# EAGLE design Inductor-based non-neighbor balancing architecture (EAGLE 6.5.0)
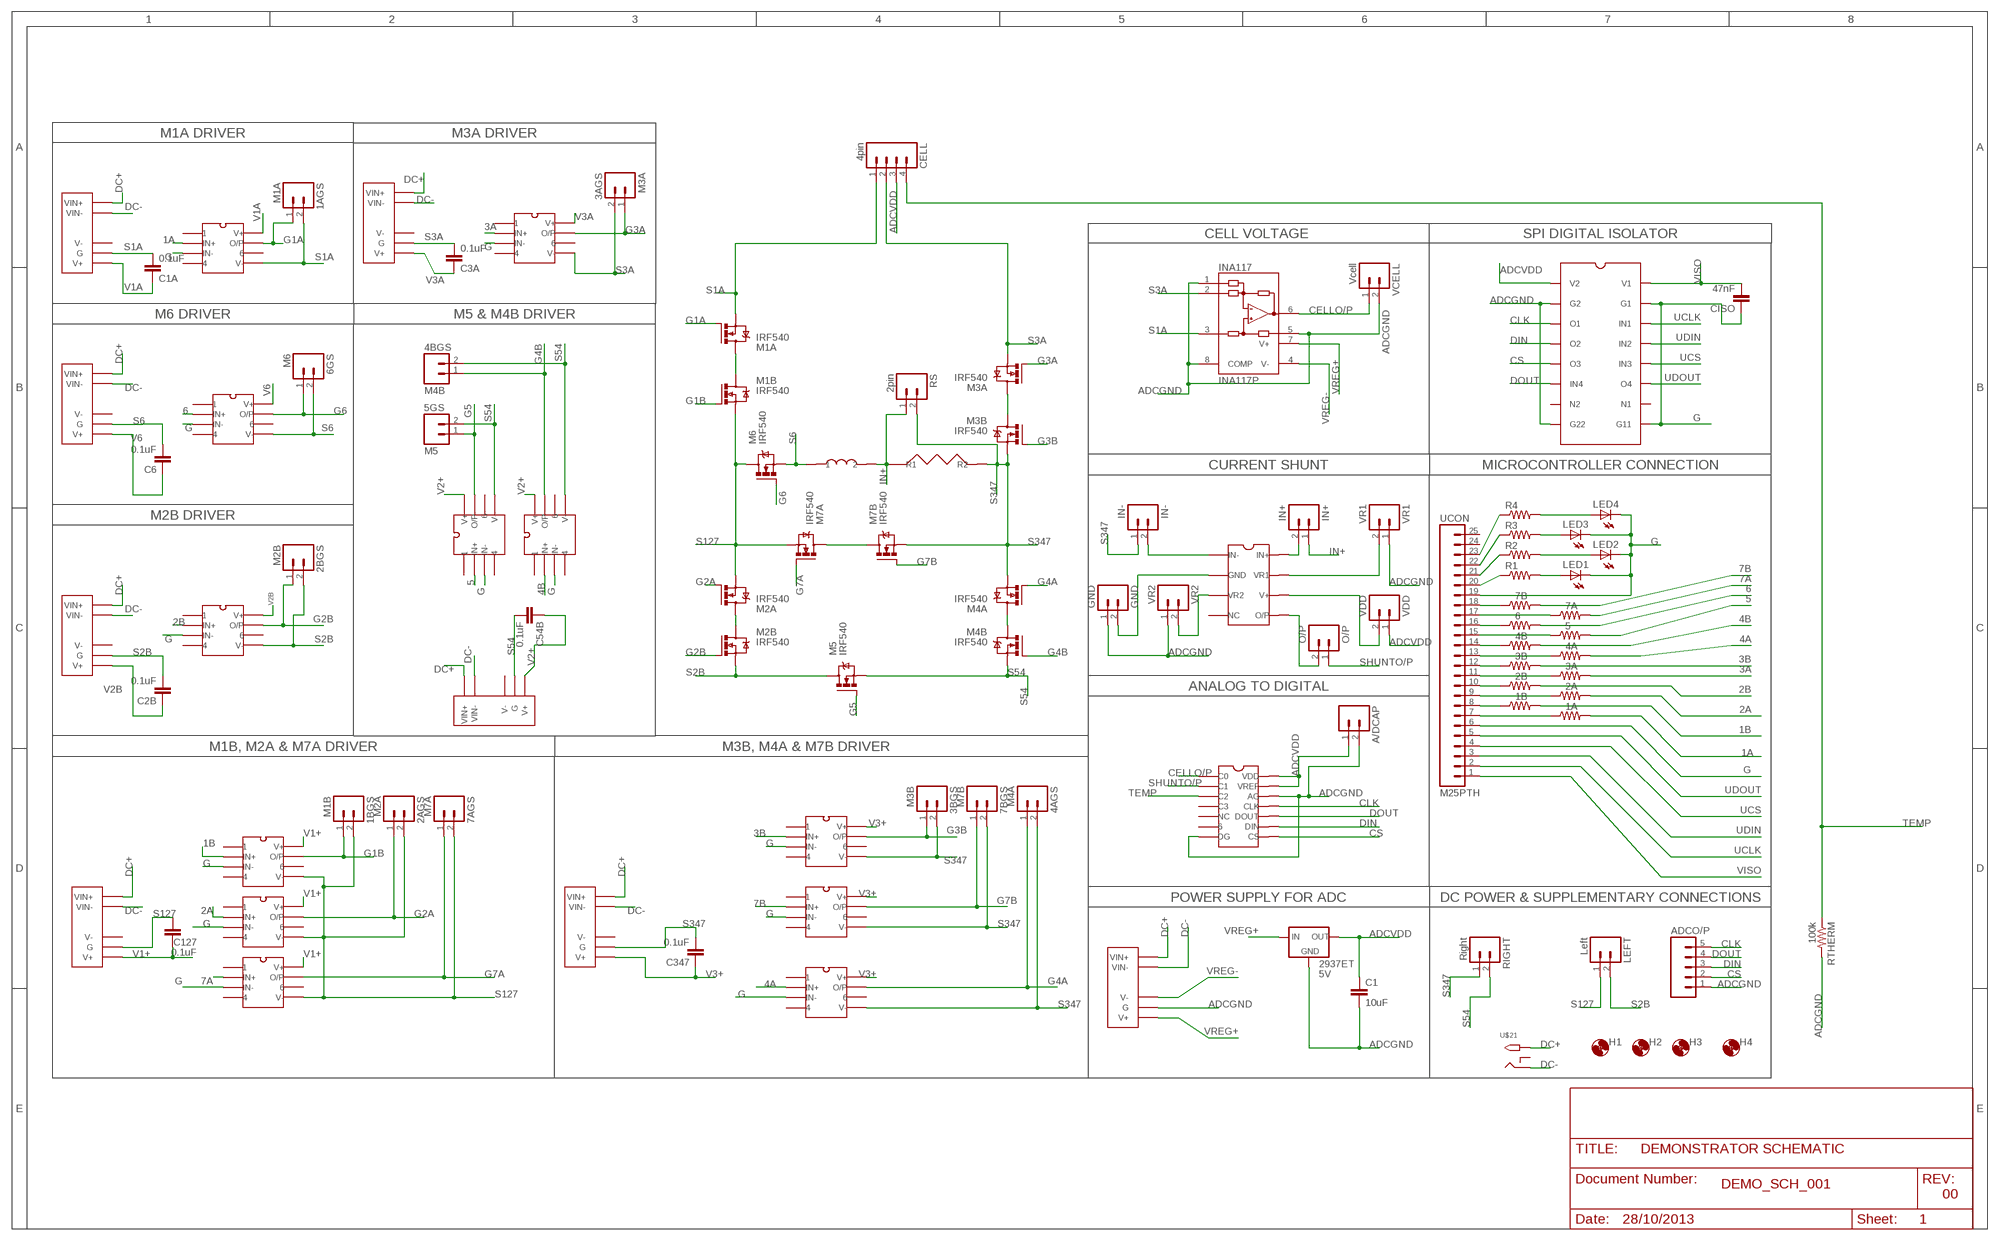
[diagram p0: schematic, sheet 1]

## Parts
1A  220  RESISTORPTH-1/2W  [AXIAL-0.5]
1AGS  M1A  M02PTH  [1X02]
1B  220  RESISTORPTH-1/2W  [AXIAL-0.5]
1BGS  M1B  M02PTH  [1X02]
2A  220  RESISTORPTH-1/2W  [AXIAL-0.5]
2AGS  M2A  M02PTH  [1X02]
2B  220  RESISTORPTH-1/2W  [AXIAL-0.5]
2BGS  M2B  M02PTH  [1X02]
3A  220  RESISTORPTH-1/2W  [AXIAL-0.5]
3AGS  M3A  M02PTH  [1X02]
3B  220  RESISTORPTH-1/2W  [AXIAL-0.5]
3BGS  M3B  M02PTH  [1X02]
4A  220  RESISTORPTH-1/2W  [AXIAL-0.5]
4AGS  M4A  M02PTH  [1X02]
4B  220  RESISTORPTH-1/2W  [AXIAL-0.5]
4BGS  M4B  M02PTH  [1X02]
5  220  RESISTORPTH-1/2W  [AXIAL-0.5]
5GS  M5  M02PTH  [1X02]
6  220  RESISTORPTH-1/2W  [AXIAL-0.5]
6GS  M6  M02PTH  [1X02]
7A  220  RESISTORPTH-1/2W  [AXIAL-0.5]
7AGS  M7A  M02PTH  [1X02]
7B  220  RESISTORPTH-1/2W  [AXIAL-0.5]
7BGS  M7B  M02PTH  [1X02]
2937ET  5V  78XXS  [78XXS]
A/DCAP  M02PTH  [1X02]
AD8210  CSM  [CSM]
ADC  ADC  [DIL14]
ADCO/P  M05PTH  [1X05]
C1  10uF  CAPPTH1  [CAP-PTH-5MM]
C1A  0.1uF  CAPPTH1  [CAP-PTH-5MM]
C2B  0.1uF  CAPPTH1  [CAP-PTH-5MM]
C3A  0.1uF  CAPPTH1  [CAP-PTH-5MM]
C6  0.1uF  CAPPTH1  [CAP-PTH-5MM]
C54B  0.1uF  CAPPTH1  [CAP-PTH-5MM]
C127  0.1uF  CAPPTH1  [CAP-PTH-5MM]
C347  0.1uF  CAPPTH1  [CAP-PTH-5MM]
CELL  4pin  M04PTH  [1X04]
CISO  47nF  CAPPTH1  [CAP-PTH-5MM]
DC/DC1A  1A  DC-DC  [DC-DC]
DC/DC2B  2B  DC-DC  [DC-DC]
DC/DC3A  3A  DC-DC  [DC-DC]
DC/DC6  6  DC-DC  [DC-DC]
DC/DC45  4B5  DC-DC  [DC-DC]
DC/DC127  1B2A7A  DC-DC  [DC-DC]
DC/DC347  3B4A7B  DC-DC  [DC-DC]
DC/DC-ADC  ADC  DC-DC  [DC-DC]
GND  GND  M02PTH  [1X02]
H1  MOUNT-HOLE3.0  [3,0]
H2  MOUNT-HOLE3.0  [3,0]
H3  MOUNT-HOLE3.0  [3,0]
H4  MOUNT-HOLE3.0  [3,0]
HCPL902J  HCPL902  [HCPL902]
IN+  IN+  M02PTH  [1X02]
IN-  IN-  M02PTH  [1X02]
INA117  INA117P  [DIL08]
LED1  LEDCHIPLED_0805  [CHIPLED_0805]
LED2  LEDCHIPLED_0805  [CHIPLED_0805]
LED3  LEDCHIPLED_0805  [CHIPLED_0805]
LED4  LEDCHIPLED_0805  [CHIPLED_0805]
LEFT  Left  M02PTH  [1X02]
M1A  IRF540  [TO220BV]
M1AD  M1A  OPTO3180  [OPTO3180]
M1B  IRF540  [TO220BV]
M1BD  M1B  OPTO3180  [OPTO3180]
M2A  IRF540  [TO220BV]
M2AD  M2A  OPTO3180  [OPTO3180]
M2B  IRF540  [TO220BV]
M2BD  M2B  OPTO3180  [OPTO3180]
M3A  IRF540  [TO220BV]
M3AD  M3A  OPTO3180  [OPTO3180]
M3B  IRF540  [TO220BV]
M3BD  M3B  OPTO3180  [OPTO3180]
M4A  IRF540  [TO220BV]
M4AD  M4A  OPTO3180  [OPTO3180]
M4B  IRF540  [TO220BV]
M4BD  M4B  OPTO3180  [OPTO3180]
M5  IRF540  [TO220BV]
M5D  M5  OPTO3180  [OPTO3180]
M6  IRF540  [TO220BV]
M6D  M6  OPTO3180  [OPTO3180]
M7A  IRF540  [TO220BV]
M7AD  M7A  OPTO3180  [OPTO3180]
M7B  IRF540  [TO220BV]
M7BD  M7B  OPTO3180  [OPTO3180]
O/P  O/P  M02PTH  [1X02]
R1  R-US_R0805  [R0805]
R2  R-US_R0805  [R0805]
R3  R-US_R0805  [R0805]
R4  R-US_R0805  [R0805]
RIGHT  Right  M02PTH  [1X02]
RS  2pin  M02PTH  [1X02]
RTHERM  100k  RESISTORPTH-1/2W  [AXIAL-0.5]
U$1  INDFINAL  [IND1MHFINAL]
U$3  RSHUNT  [RSHUNT]
U$21  2.1MMJACKTHM  [PJ-102A]
UCON  M25PTH  [1X25]
VCELL  Vcell  M02PTH  [1X02]
VDD  VDD  M02PTH  [1X02]
VR1  VR1  M02PTH  [1X02]
VR2  VR2  M02PTH  [1X02]

## Nets
1A: 1A.P$2 M1AD.IN+
1B: 1B.P$2 M1BD.IN+
2A: 2A.P$2 M2AD.IN+
2B: 2B.P$2 M2BD.IN+
3A: 3A.P$2 M3AD.IN+
3B: 3B.P$2 M3BD.IN+
4A: 4A.P$2 M4AD.IN+
4B: 4B.P$2 M4BD.IN+
5: 5.P$2 M5D.IN+
6: 6.P$2 M6D.IN+
7A: 7A.P$2 M7AD.IN+
7B: 7B.P$2 M7BD.IN+
ADCGND: 2937ET.GND A/DCAP.2 ADC.AGND(AG) ADC.DGND(DG) ADCO/P.1 C1.2 DC/DC-ADC.G GND.1 HCPL902J.G2 HCPL902J.G22 INA117.1(REFB) INA117.5(REFA) INA117.8(COMP) RTHERM.P$2 VCELL.2 VR1.1 VR2.1
ADCVDD: 2937ET.OUT A/DCAP.1 ADC.VDD ADC.VREF C1.1 CELL.3 HCPL902J.V2 VDD.1
CELLO/P: ADC.CH0(C0) INA117.6(OUT) VCELL.1
CLK: ADC.CLK ADCO/P.5 HCPL902J.OUT1(O1)
CS: ADC.CS ADCO/P.2 HCPL902J.OUT3(O3)
DC+: DC/DC1A.VIN+ DC/DC2B.VIN+ DC/DC3A.VIN+ DC/DC6.VIN+ DC/DC45.VIN+ DC/DC127.VIN+ DC/DC347.VIN+ DC/DC-ADC.VIN+ U$21.TIP
DC-: DC/DC1A.VIN- DC/DC2B.VIN- DC/DC3A.VIN- DC/DC6.VIN- DC/DC45.VIN- DC/DC127.VIN- DC/DC347.VIN- DC/DC-ADC.VIN- U$21.RING
DIN: ADC.DIN ADCO/P.3 HCPL902J.OUT2(O2)
DOUT: ADC.DOUT ADCO/P.4 HCPL902J.IN4
G: CISO.1 HCPL902J.G1 HCPL902J.G11 LED1.C LED2.C LED3.C LED4.C M1AD.IN- M1BD.IN- M2AD.IN- M2BD.IN- M3AD.IN- M3BD.IN- M4AD.IN- M4BD.IN- M5D.IN- M6D.IN- M7AD.IN- M7BD.IN- UCON.6 UCON.19
G1A: 1AGS.1 M1A.G M1AD.O/P
G1B: 1BGS.1 M1B.G M1BD.O/P
G2A: 2AGS.1 M2A.G M2AD.O/P
G2B: 2BGS.1 M2B.G M2BD.O/P
G3A: 3AGS.1 M3A.G M3AD.O/P
G3B: 3BGS.1 M3B.G M3BD.O/P
G4A: 4AGS.1 M4A.G M4AD.O/P
G4B: 4BGS.1 M4B.G M4BD.O/P
G5: 5GS.1 M5.G M5D.O/P
G6: 6GS.1 M6.G M6D.O/P
G7A: 7AGS.1 M7A.G M7AD.O/P
G7B: 7BGS.1 M7B.G M7BD.O/P
IN+: IN+.1 RS.1 U$1.2 U$3.R1
N$1: M1A.D M1B.D
N$2: M4A.D M4B.D
N$3: AD8210.VR2 VR2.2
N$4: M7A.D M7B.D
N$5: M2A.D M2B.D
N$6: AD8210.IN- IN-.2
N$7: AD8210.GND GND.2
N$8: AD8210.V+ VDD.2
N$9: M3A.D M3B.D
N$10: AD8210.O/P O/P.2
N$11: AD8210.VR1 VR1.2
N$12: AD8210.IN+ IN+.2
N$13: 1A.P$1 UCON.7
N$14: 1B.P$1 UCON.8
N$15: 2A.P$1 UCON.9
N$16: 2B.P$1 UCON.10
N$17: 3A.P$1 UCON.11
N$18: 3B.P$1 UCON.12
N$19: 4A.P$1 UCON.13
N$20: 4B.P$1 UCON.14
N$21: 5.P$1 UCON.15
N$22: 6.P$1 UCON.16
N$23: 7A.P$1 UCON.17
N$24: 7B.P$1 UCON.18
N$25: LED2.A R2.2
N$26: LED1.A R1.2
N$27: LED4.A R4.2
N$28: R2.1 UCON.21
N$31: R3.1 UCON.22
N$32: LED3.A R3.2
N$34: R4.1 UCON.23
R4: R1.1 UCON.20
S1A: 1AGS.2 C1A.2 CELL.1 DC/DC1A.G INA117.3(+IN) M1A.S M1AD.V-
S2B: 2BGS.2 C2B.2 DC/DC2B.G LEFT.2 M2B.S M2BD.V- M5.D
S3A: 3AGS.2 C3A.2 CELL.2 DC/DC3A.G INA117.2(-IN) M3A.S M3AD.V-
S6: 6GS.2 C6.2 DC/DC6.G M6.S M6D.V- U$1.1
S54: 4BGS.2 5GS.2 C54B.2 DC/DC45.G M4B.S M4BD.V- M5.S M5D.V- RIGHT.2
S127: 1BGS.2 2AGS.2 7AGS.2 C127.2 DC/DC127.G LEFT.1 M1B.S M1BD.V- M2A.S M2AD.V- M6.D M7A.S M7AD.V-
S347: 3BGS.2 4AGS.2 7BGS.2 C347.2 DC/DC347.G IN-.1 M3B.S M3BD.V- M4A.S M4AD.V- M7B.S M7BD.V- RIGHT.1 RS.2 U$3.R2
SHUNTO/P: ADC.CH1(C1) O/P.1
TEMP: ADC.CH2(C2) CELL.4 RTHERM.P$1
UCLK: HCPL902J.IN1 UCON.2
UCS: HCPL902J.IN3 UCON.4
UDIN: HCPL902J.IN2 UCON.3
UDOUT: HCPL902J.OUT4(O4) UCON.5
V1+: C127.1 DC/DC127.V+ M1BD.V+ M2AD.V+ M7AD.V+
V1A: C1A.1 DC/DC1A.V+ M1AD.V+
V2+: C54B.1 DC/DC45.V+ M4BD.V+ M5D.V+
V2B: C2B.1 DC/DC2B.V+ M2BD.V+
V3+: C347.1 DC/DC347.V+ M3BD.V+ M4AD.V+ M7BD.V+
V3A: C3A.1 DC/DC3A.V+ M3AD.V+
V6: C6.1 DC/DC6.V+ M6D.V+
VISO: CISO.2 HCPL902J.V1 UCON.1
VREG+: 2937ET.IN DC/DC-ADC.V+ INA117.7(V+)
VREG-: DC/DC-ADC.V- INA117.4(V-)
Unconnected: AD8210.NC ADC.6 ADC.CH3(C3) ADC.NC DC/DC1A.V- DC/DC2B.V- DC/DC3A.V- DC/DC6.V- DC/DC45.V- DC/DC127.V- DC/DC347.V- HCPL902J.N1 HCPL902J.N2 M1AD.1 M1AD.4 M1AD.6 M1BD.1 M1BD.4 M1BD.6 M2AD.1 M2AD.4 M2AD.6 M2BD.1 M2BD.4 M2BD.6 M3AD.1 M3AD.4 M3AD.6 M3BD.1 M3BD.4 M3BD.6 M4AD.1 M4AD.4 M4AD.6 M4BD.1 M4BD.4 M4BD.6 M5D.1 M5D.4 M5D.6 M6D.1 M6D.4 M6D.6 M7AD.1 M7AD.4 M7AD.6 M7BD.1 M7BD.4 M7BD.6 U$21.RING_SW UCON.24 UCON.25

## Notes on the sheet
- M1A DRIVER | M3A DRIVER
- CELL VOLTAGE | SPI DIGITAL ISOLATOR
- M6 DRIVER | M5 & M4B DRIVER
- CURRENT SHUNT | MICROCONTROLLER CONNECTION
- M2B DRIVER
- ANALOG TO DIGITAL
- M1B, M2A & M7A DRIVER | M3B, M4A & M7B DRIVER
- POWER SUPPLY FOR ADC | DC POWER & SUPPLEMENTARY CONNECTIONS

## Library data of the parts
1A 1B 2A 2B 3A 3B 4A 4B 5 6 7A 7B RTHERM = SparkFun-Passives:RESISTOR: Resistor Basic schematic elements and footprints for 0603, 1206, and PTH resistors.
1AGS 1BGS 2AGS 2BGS 3AGS 3BGS 4AGS 4BGS 5GS 6GS 7AGS 7BGS A/DCAP GND IN+ IN- LEFT O/P RIGHT RS VCELL VDD VR1 VR2 = SparkFun-Connectors:M02: Header 2 Standard 2-pin 0.1" header. Use with straight break away headers (SKU : PRT-00116), right angle break away headers (PRT-00553), swiss pins (PRT-00743), machine pins (PRT-00117), and female headers (PRT-00115). Molex polarized connector foot print use with SKU : PRT-08233 with associated crimp pins and housings.
2937ET = v-reg:78XXS: VOLTAGE REGULATOR
AD8210 = csm:CSM
ADC = ADC:ADC
ADCO/P = M25:M05: Header 5 Standard 5-pin 0.1" header. Use with straight break away headers (SKU : PRT-00116), right angle break away headers (PRT-00553), swiss pins (PRT-00743), machine pins (PRT-00117), and female headers (PRT-00115). Molex polarized connector foot print use with SKU : PRT-08230 with associated crimp pins and housings.
C1 = SparkFun-Capacitors:CAP: Capacitor Standard 0603 ceramic capacitor, and 0.1" leaded capacitor.
C1A C2B C3A C6 C54B C127 C347 CISO = SparkFun-Passives:CAP: Capacitor Standard 0603 ceramic capacitor, and 0.1" leaded capacitor.
CELL = SparkFun-Connectors:M04: Header 4 Standard 4-pin 0.1" header. Use with straight break away headers (SKU : PRT-00116), right angle break away headers (PRT-00553), swiss pins (PRT-00743), machine pins (PRT-00117), and female headers (PRT-00115). Molex polarized connector foot print use with SKU : PRT-08231 with associated crimp pins and housings. 1MM SMD Version SKU: PRT-10208
DC/DC1A DC/DC2B DC/DC3A DC/DC6 DC/DC45 DC/DC127 DC/DC347 DC/DC-ADC = DC-DC:DC-DC
H1-H4 = holes:MOUNT-HOLE: MOUNTING HOLE with drill center marker
HCPL902J = hcpl902:HCPL902
INA117 = burr-brown:INA117: Difference Amplifier High Common-Mode Voltage; MF: TEXAS INSTRUMENTS; MPN: INA117P; OC_FARNELL: 1470350; OC_NEWARK: 74K3811
LED1-LED4 = adafruit:LED: LED OSRAM: - CHIPLED LG R971, LG N971, LY N971, LG Q971, LY Q971, LO R971, LY R971 LH N974, LH R974 LS Q976, LO Q976, LY Q976 LO Q996 - Hyper CHIPLED LW Q18S LB Q993, LB Q99A, LB R99A - SideLED LS A670, LO A670, LY A670, LG A670, LP A670 LB A673, LV A673, LT A673, LW A673 LH A674 LY A675 LS A676, LA A676, LO A676, LY A676, LW A676 LS A679, LY A679, LG A679 - Hyper Micro SIDELED® LS Y876, LA Y876, LO Y876, LY Y876 LT Y87S - SmartLED LW L88C, LW L88S LB L89C, LB L89S, LG L890 LS L89K, LO L89K, LY L89K LS L896, LA L896, LO L896, LY L896 - TOPLED LS T670, LO T670, LY T670, LG T670, LP T670 LSG T670, LSP T670, LSY T670, LOP T670, LYG T670 LG T671, LOG T671, LSG T671 LB T673, LV T673, LT T673, LW T673 LH T674 LS T676, LA T676, LO T676, LY T676, LB T676, LH T676, LSB T676, LW T676 LB T67C, LV T67C, LT T67C, LS T67K, LO T67K, LY T67K, LW E67C LS E67B, LA E67B, LO E67B, LY E67B, LB E67C, LV E67C, LT E67C LW T67C LS T679, LY T679, LG T679 LS T770, LO T770, LY T770, LG T770, LP T770 LB T773, LV T773, LT T773, LW T773 LH T774 LS E675, LA E675, LY E675, LS T675 LS T776, LA T776, LO T776, LY T776, LB T776 LHGB T686 LT T68C, LB T68C - Hyper Mini TOPLED® LB M676 - Mini TOPLED Santana® LG M470 LS M47K, LO M47K, LY M47K Source: http://www.osram.convergy.de/
M1A M1B M2A M2B M3A M3B M4A M4B M5 M6 M7A M7B = transistor-power:IRF540: HEXFET Power MOSFET
M1AD M1BD M2AD M2BD M3AD M3BD M4AD M4BD M5D M6D M7AD M7BD = opto3180:OPTO3180
R1-R4 = adafruit:R-US_: RESISTOR, American symbol
U$1 = ind1mhfinal:INDFINAL
U$3 = rshunt:RSHUNT
U$21 = adafruit:2.1MMJACK: 2.1mm x 5.5mm THM DC jack with internal switch. Digikey part #PJ-102A, 4UCON part #05537 2.1mm x 5.5mm SMT DC jack with internal switch. Digikey part #PJ-002A-SMT, 4UCON part #03267 By microbuilder.eu & adafruit.com
UCON = M25:M25: 1x25 .1" header

## Net classes
0 default: width 0.381 mm, drill 0.635 mm, clearance 0.381 mm

## Board
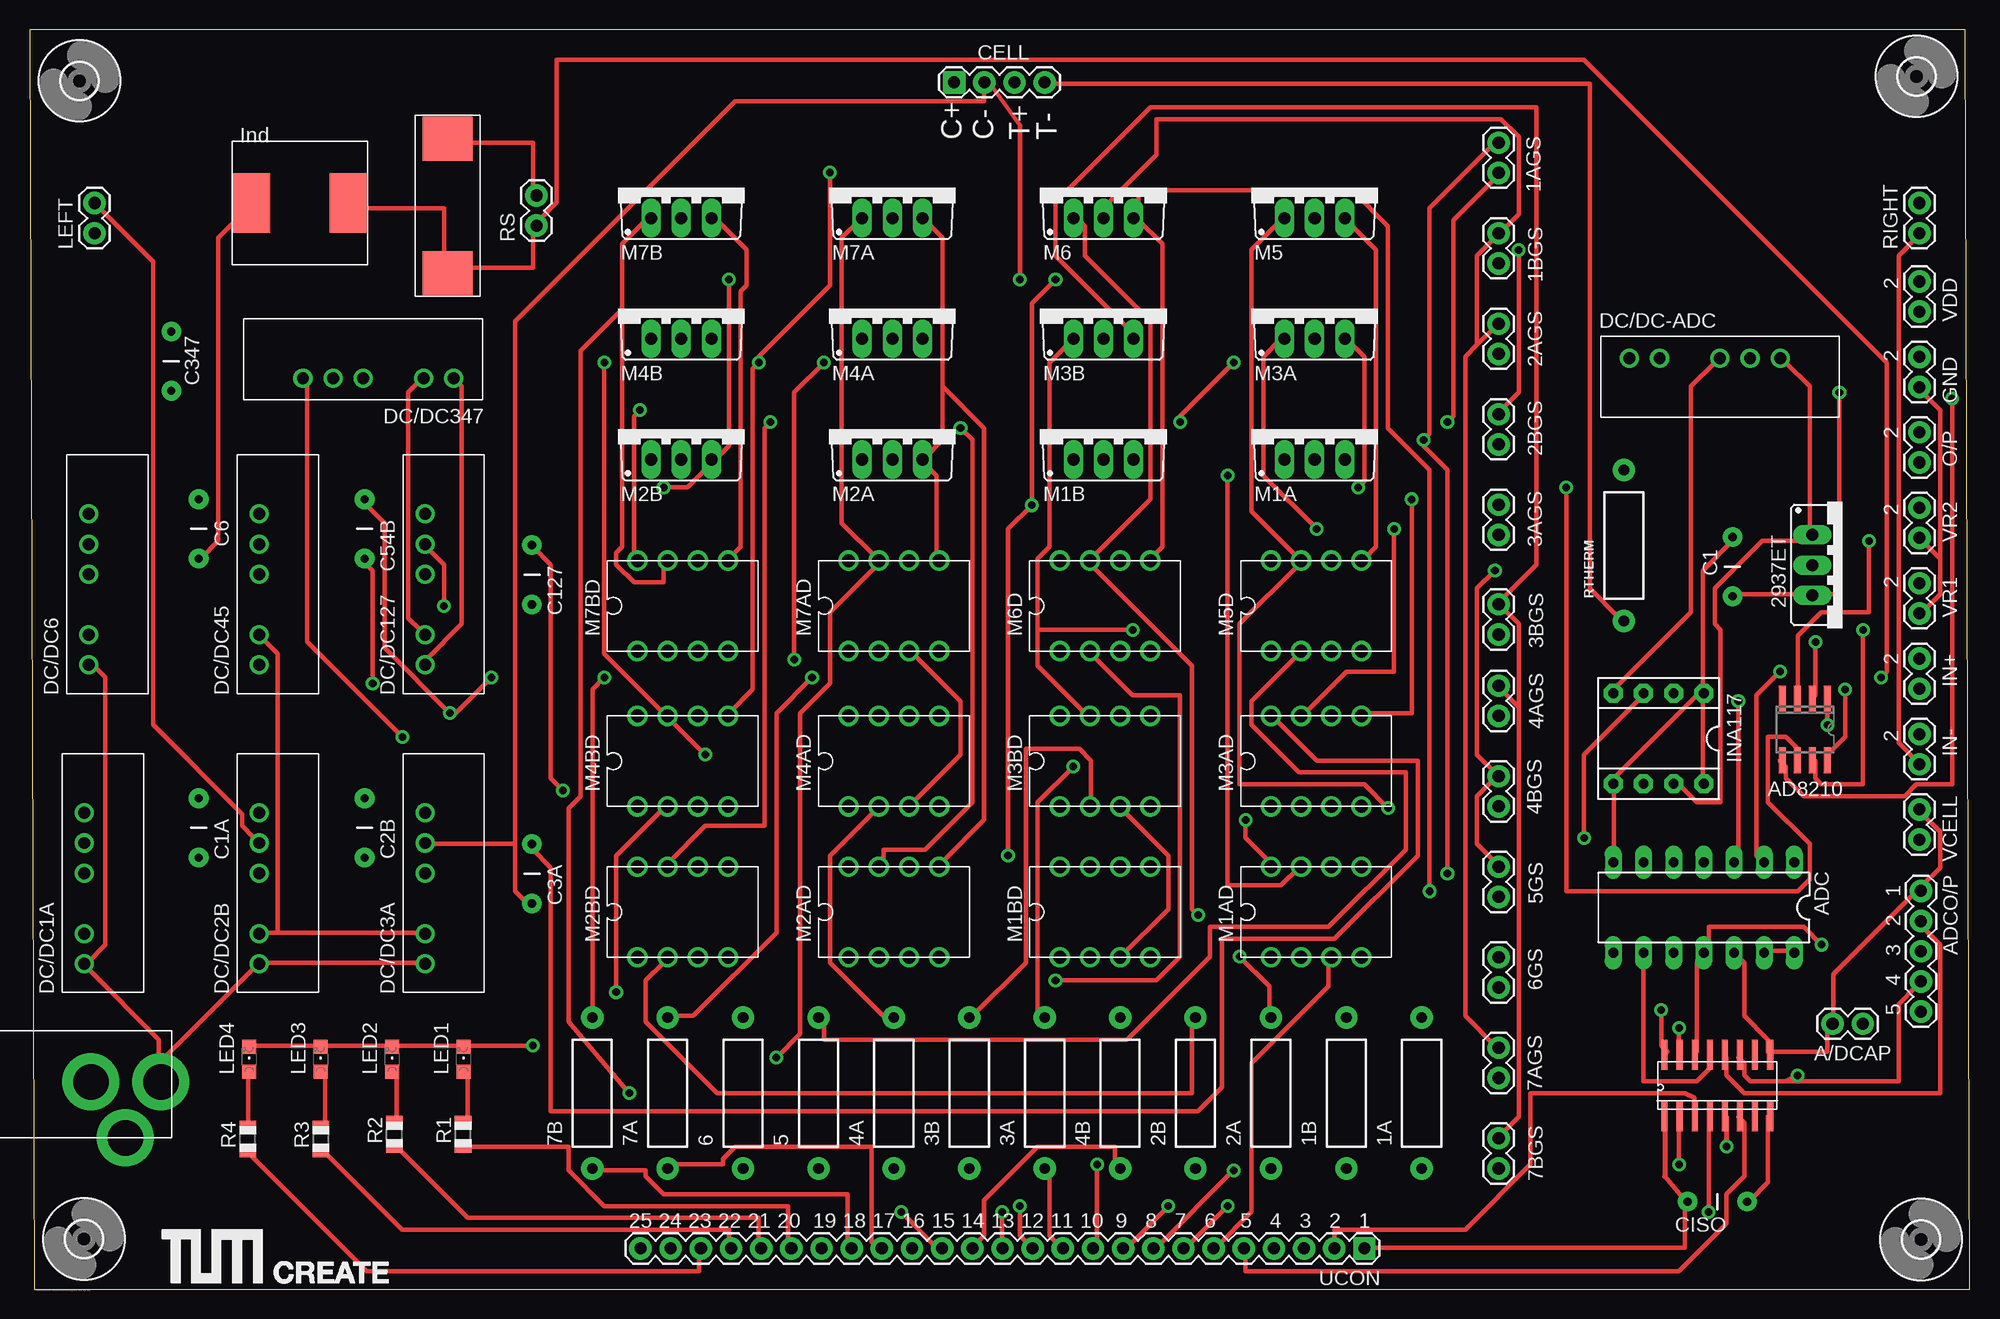
[diagram p1: board, top side]
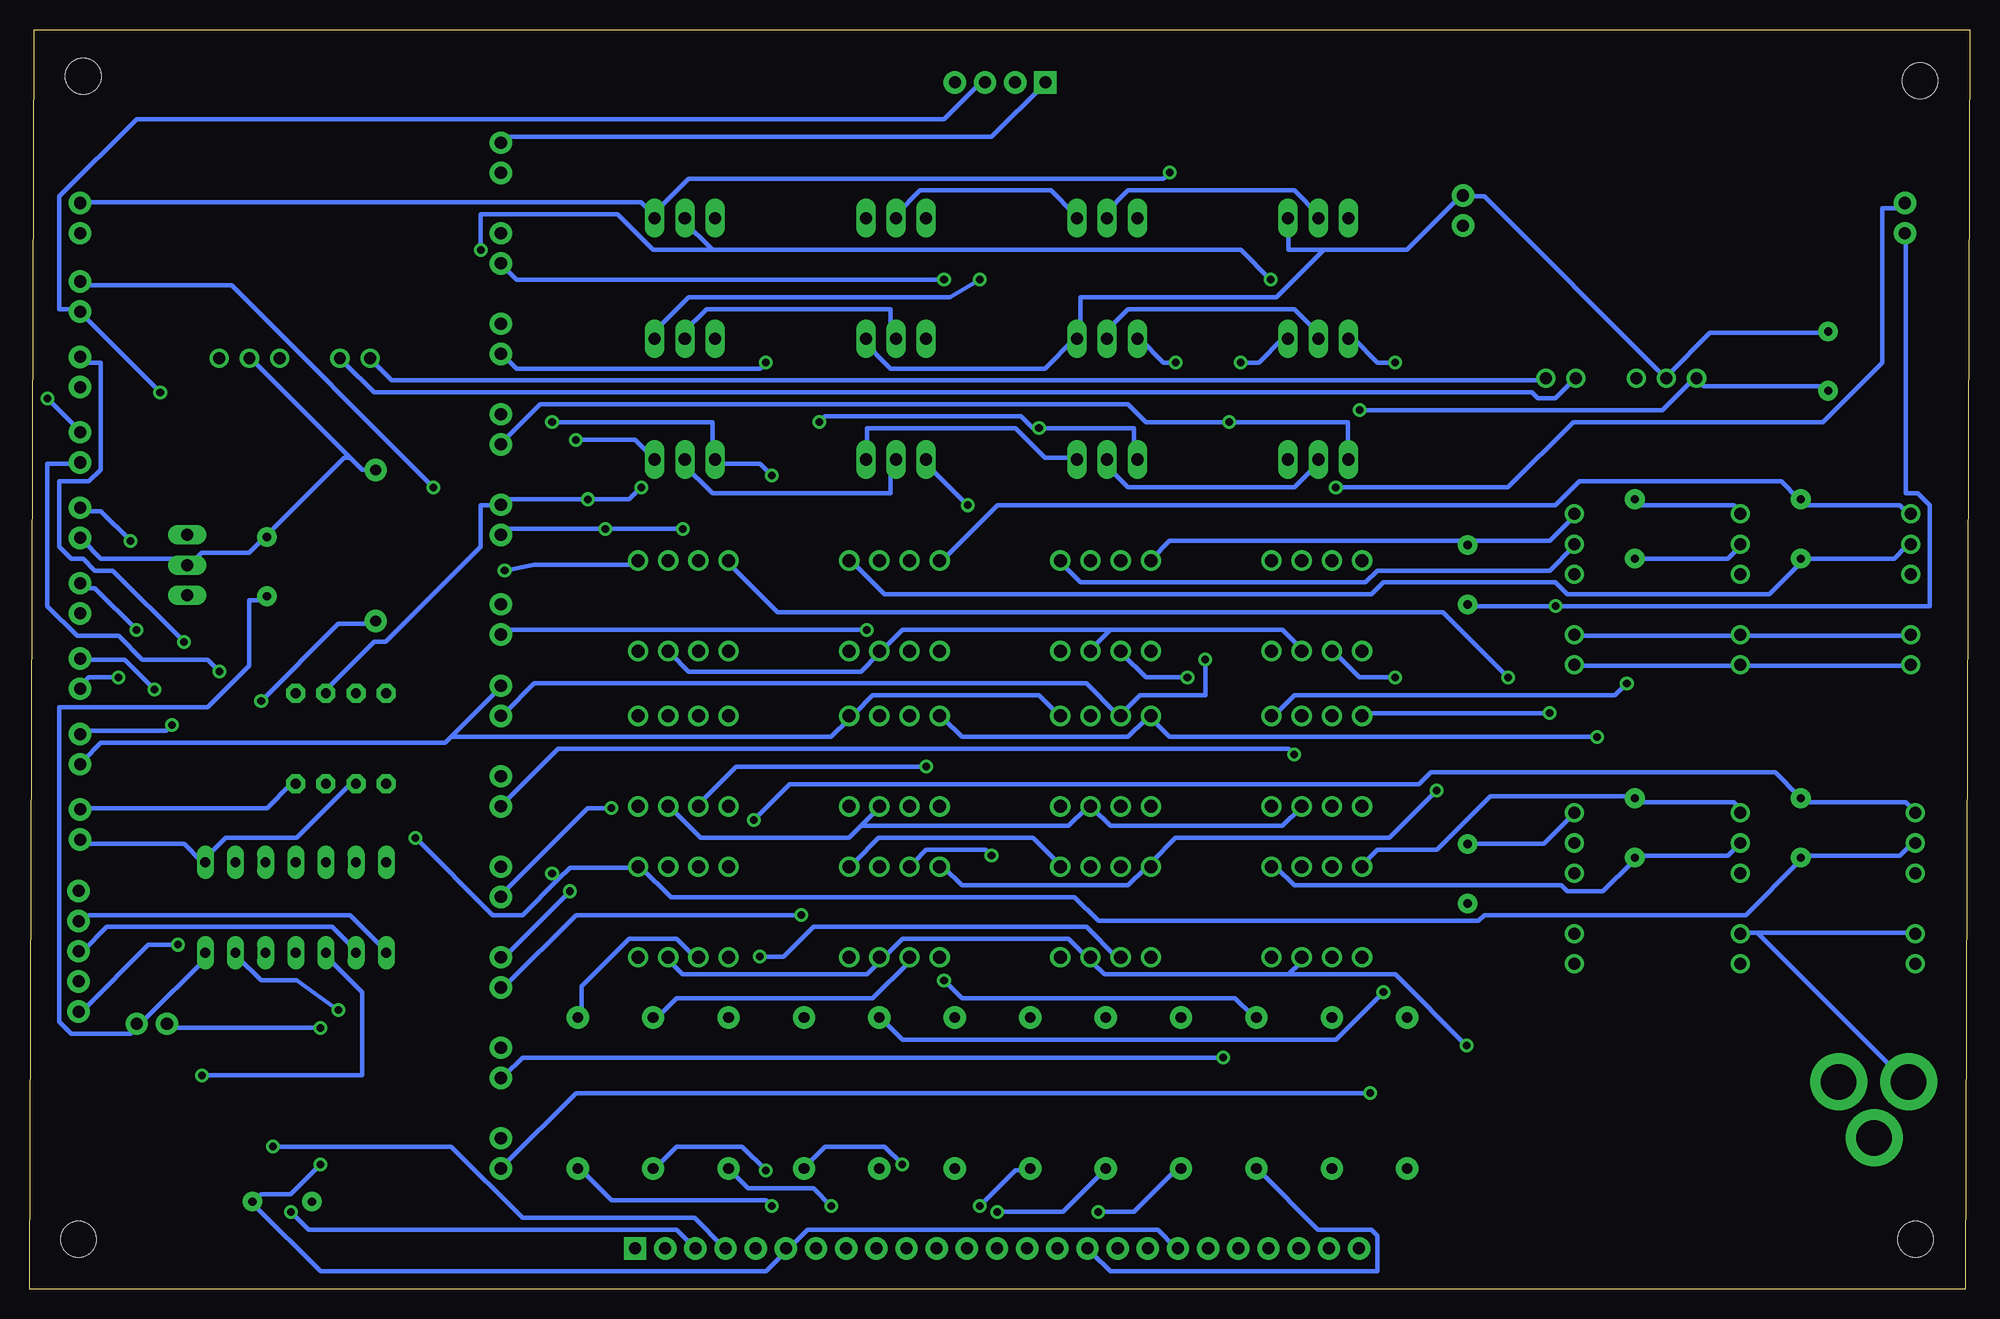
[diagram p2: board, bottom side, seen from below]

Size 163.37 x 106.03 mm. Coordinates in mm from the lower left corner, seen from the top.
Outline: 0.38,0 163.37,0 162.99,106.03 0,106.03 0.38,0
Copper layers (1*16): Top 0.035mm / dielectric 1.5mm / Bottom 0.035mm
Design rules "SparkfunDRC1use *": minimum track width 12mil, minimum drill 20mil, track to track 12mil, track to pad 12mil, pad to pad 12mil, via to via 12mil, smd to smd 8mil, copper to edge 15mil, drill to drill 12mil, minimum pad ring 12mil, minimum via ring 10mil, stop-mask expansion 4mil, vias tented up to drill 25mil, thermal gap 10mil

### Footprints (pad centres in the part's own frame; a part is rotated, then mirrored left to right if it is on the bottom)
AXIAL-0.5 = drill 0.9 pad 1.88: P$1 -6.35,0; P$2 6.35,0
1X02 = drill 1.016 pad 1.88: 1 0,0; 2 2.54,0
78XXS = drill 1.016 long: GND 0,-2.54; IN -2.54,-2.54; OUT 2.54,-2.54
CSM = smd 0.6 x 2.2: GND -0.635,-2.6; IN+ -1.905,2.6; IN- -1.905,-2.6; NC 1.905,-2.6; O/P 1.905,2.6; V+ 0.635,2.6; VR1 -0.635,2.6; VR2 0.635,-2.6
DIL14 = drill 0.813 long: 6 5.08,-3.81; AGND -2.54,3.81; CH0 -7.62,-3.81; CH1 -5.08,-3.81; CH2 -2.54,-3.81; CH3 0,-3.81; CLK 0,3.81; CS 7.62,3.81; DGND 7.62,-3.81; DIN 5.08,3.81; DOUT 2.54,3.81; NC 2.54,-3.81; VDD -7.62,3.81; VREF -5.08,3.81
1X05 = drill 1.016 pad 1.88: 1 0,0; 2 2.54,0; 3 5.08,0; 4 7.62,0; 5 10.16,0
CAP-PTH-5MM = drill 0.7 pad 1.651: 1 -2.5,0; 2 2.5,0
1X04 = drill 1.016 pad 1.88 square: 1 0,0 | drill 1.016 pad 1.88: 2 2.54,0; 3 5.08,0; 4 7.62,0
DC-DC = drill 1: G 5.08,0; V+ 7.62,0; V- 2.54,0; VIN+ -5.08,0; VIN- -2.54,0
3,0 = hole 3: 0,0
HCPL902 = smd 0.508 x 2.54: G1 3.18,2.6; G2 3.18,-2.6; G11 -4.44,2.6; G22 -4.44,-2.6; IN1 1.91,2.6; IN2 0.63,2.6; IN3 -0.64,2.6; IN4 -1.9,-2.6; N1 -3.17,2.6; N2 -3.17,-2.6; OUT1 1.91,-2.6; OUT2 0.63,-2.6; OUT3 -0.64,-2.6; OUT4 -1.9,2.6; V1 4.45,2.6; V2 4.45,-2.6
DIL08 = drill 0.813 pad 1.6 octagon: 1 -3.81,-3.81; 2 -1.27,-3.81; 3 1.27,-3.81; 4 3.81,-3.81; 5 3.81,3.81; 6 1.27,3.81; 7 -1.27,3.81; 8 -3.81,3.81
CHIPLED_0805 = smd 1.2 x 1.2: A 0,-1.05; C 0,1.05
TO220BV = drill 1.016 long: D 0,-2.54; G -2.54,-2.54; S 2.54,-2.54
OPTO3180 = drill 1.1: 1 -3.81,-3.81; 4 3.81,-3.81; 6 1.27,3.81; IN+ -1.27,-3.81; IN- 1.27,-3.81; O/P -1.27,3.81; V+ -3.81,3.81; V- 3.81,3.81
R0805 = smd 1.1 x 1.4: 1 -1,0; 2 1,0
IND1MHFINAL = smd 3.2 x 5: 1 -4.1,0; 2 4.1,0
RSHUNT = smd 3.7 x 4.2: R1 -5.65,0; R2 5.65,0
PJ-102A = drill 3 pad 4.8: RING 0.1,-3.39; RING_SW -4.6,-6.29; TIP 0.1,-9.29
1X25 = drill 1.016 pad 1.88 square: 1 0,0 | drill 1.016 pad 1.88: 2 2.54,0; 3 5.08,0; 4 7.62,0; 5 10.16,0; 6 12.7,0; 7 15.24,0; 8 17.78,0; 9 20.32,0; 10 22.86,0; 11 25.4,0; 12 27.94,0; 13 30.48,0; 14 33.02,0; 15 35.56,0; 16 38.1,0; 17 40.64,0; 18 43.18,0; 19 45.72,0; 20 48.26,0; 21 50.8,0; 22 53.34,0; 23 55.88,0; 24 58.42,0; 25 60.96,0

### Placement (x,y rotation side)
1A  117.22,16.51 90 top
1AGS  123.7,93.98 90 top
1B  110.87,16.51 90 top
1BGS  123.7,86.36 90 top
2A  104.52,16.51 90 top
2AGS  123.7,78.74 90 top
2B  98.17,16.51 90 top
2BGS  123.7,71.12 90 top
3A  85.47,16.51 90 top
3AGS  123.7,63.5 90 top
3B  79.12,16.51 90 top
3BGS  123.7,55.12 90 top
4A  72.77,16.51 90 top
4AGS  123.7,48.26 90 top
4B  91.82,16.51 90 top
4BGS  123.7,40.64 90 top
5  66.42,16.51 90 top
5GS  123.7,33.02 90 top
6  60.07,16.51 90 top
6GS  123.7,25.4 90 top
7A  53.72,16.51 90 top
7AGS  123.7,17.78 90 top
7B  47.37,16.51 90 top
7BGS  123.7,10.16 90 top
2937ET  152.65,60.96 270 top
A/DCAP  154.36,22.35 180 top
AD8210  149.48,47.12 180 top
ADC  140.97,32.13 180 top
ADCO/P  159.26,33.53 270 top
C1  143.38,60.83 90 top
C1A  14.24,38.83 270 top
C2B  28.21,38.83 270 top
C3A  42.29,34.98 270 top
C6  14.24,64 270 top
C54B  28.21,64 270 top
C127  42.29,60.15 270 top
C347  11.92,78.13 90 top
CELL  77.85,101.6 0 top
CISO  142.11,7.37 180 top
DC/DC1A  4.58,32.48 90 top
DC/DC2B  19.32,32.48 90 top
DC/DC3A  33.29,32.48 90 top
DC/DC6  4.97,57.65 90 top
DC/DC45  19.32,57.65 90 top
DC/DC127  33.29,57.65 90 top
DC/DC347  30.63,76.7 180 top
DC/DC-ADC  139.79,78.38 0 top
GND  159.13,75.95 90 top
H1  4.57,4.22 0 top
H2  159.26,4.19 0 top
H3  158.88,102.11 0 top
H4  4.19,101.73 0 top
HCPL902J  142.11,17.14 180 top
IN+  159.13,50.55 90 top
IN-  159.13,44.2 90 top
INA117  137.16,46.35 180 top
LED1  36.54,19.35 0 top
LED2  30.52,19.35 0 top
LED3  24.5,19.35 0 top
LED4  18.48,19.35 0 top
LEFT  5.46,88.9 90 top
M1A  108.2,72.39 0 top
M1AD  108.33,31.75 0 top
M1B  90.42,72.39 0 top
M1BD  90.55,31.75 0 top
M2A  72.64,72.39 0 top
M2AD  72.77,31.75 0 top
M2B  54.86,72.39 0 top
M2BD  54.99,31.75 0 top
M3A  108.2,82.55 0 top
M3AD  108.33,44.45 0 top
M3B  90.42,82.55 0 top
M3BD  90.55,44.45 0 top
M4A  72.64,82.55 0 top
M4AD  72.77,44.45 0 top
M4B  54.86,82.55 0 top
M4BD  54.99,44.45 0 top
M5  108.2,92.71 0 top
M5D  108.33,57.53 0 top
M6  90.42,92.71 0 top
M6D  90.55,57.53 0 top
M7A  72.64,92.71 0 top
M7AD  72.77,57.53 0 top
M7B  54.86,92.71 0 top
M7BD  54.99,57.53 0 top
O/P  159.13,69.6 90 top
R1  36.5,13.03 90 top
R2  30.71,13.03 90 top
R3  24.54,12.65 90 top
R4  18.36,12.65 90 top
RIGHT  159.13,88.9 90 top
RS  42.67,89.53 90 top
RTHERM  134.24,62.61 90 top
U$1  22.76,91.45 0 top
U$3  35.19,91.2 90 top
U$21  1.76,17.34 90 top
UCON  112.39,3.43 180 top
VCELL  159.13,37.85 90 top
VDD  159.13,82.3 90 top
VR1  159.13,56.9 90 top
VR2  159.13,63.25 90 top

### Tracks (layer width: path | path; a pad name or v marks a point on that pad's centre or on a via)
1A
  Bottom 0.381: M1AD.IN+ 107.38,28 108.88,29.5 112.88,29.5 116.88,25.5 116.88,23 1A.P$2
1B
  Bottom 0.381: M1BD.IN+ 89.38,27.5 92.38,24.5 108.88,24.5 110.38,23 1B.P$2
2A  (via drill 0.64)
  Top 0.381: v101.88,28 104.38,25.5 104.38,23 2A.P$2
  Bottom 0.381: v101.88,28 99.88,28 97.38,30.5 74.38,30.5 71.88,28 M2AD.IN+
2B
  Top 0.381: M2BD.IN+ 53.38,27.5 51.88,26 51.88,22.5 57.88,16.5 97.88,16.5 97.88,22.5 2B.P$2
3A  (via drill 0.64)
  Top 0.381: v87.88,44 84.88,41 84.88,23.5 85.38,23 3A.P$2
  Bottom 0.381: v87.88,44 103.88,44 106.88,41 M3AD.IN+
3B
  Top 0.381: M3BD.IN+ 89.38,41 89.38,44.5 88.38,45.5 83.88,45.5 83.88,27.5 79.38,23 3B.P$2
4A
  Top 0.381: M4AD.IN+ 71.38,40.5 67.38,36.5 67.38,27.5 72.38,22.5 4A.P$2
4B  (via drill 0.64)
  Top 0.381: v49.38,25 49.38,36.5 53.38,40.5 M4BD.IN+
  Bottom 0.381: v49.38,25 53.38,21 89.88,21 91.38,22.5 4B.P$2
5
  Top 0.381: M5D.IN+ 106.88,53.5 102.88,49.5 102.88,47.5 106.88,43.5 115.88,43.5 115.88,37 109.38,30.5 99.38,30.5 99.38,28 92.38,21 66.88,21 66.88,22.5 5.P$2
6  (via drill 0.64)
  Top 0.381: v86.38,26 94.88,26 96.88,28 96.88,50 92.88,50 89.38,53.5 M6D.IN+
  Bottom 0.381: v86.38,26 84.88,24.5 61.88,24.5 60.38,23 6.P$2
7A  (via drill 0.64)
  Top 0.381: v65.88,51.5 62.88,48.5 62.88,30 55.88,23 53.88,23 7A.P$2
  Bottom 0.381: v65.88,51.5 69.38,51.5 71.38,53.5 M7AD.IN+
7B  (via drill 0.64)
  Top 0.381: v48.38,51.5 47.38,50.5 47.38,23 7B.P$2
  Bottom 0.381: v48.38,51.5 51.38,51.5 53.38,53.5 M7BD.IN+
ADCGND  (via drill 0.64)
  Top 0.381: 160.88,61.5 160.88,58.5 159.38,57 VR1.1 | 160.88,61.5 159.38,63 VR2.1 | 160.88,61.5 160.88,74 159.38,75.5 GND.1 | ADC.DGND 133.38,36 133.38,42.5 INA117.5 133.38,43 140.88,50.5 | INA117.8 140.88,43 140.88,50 INA117.1 140.88,50.5 | VCELL.2 159.38,40 160.88,38.5 160.88,35.5 159.38,34 ADCO/P.1 158.88,33.5 151.88,26.5 151.88,22.5 A/DCAP.2 151.38,22 151.38,20 146.38,20 | v138.88,22 138.88,20 HCPL902J.G2 | 146.38,20 146.38,21 144.38,23 144.38,27.5 143.88,28 ADC.AGND | 146.38,20 HCPL902J.G22 | 140.88,50.5 140.88,60.5 143.38,63 C1.2
  Bottom 0.381: 149.38,61.5 148.88,62 144.88,62 143.88,63 C1.2 143.38,63.5 136.88,70 136.38,70 | 149.38,61.5 149.88,61 2937ET.GND 149.38,61.5 | 136.38,70 135.38,69 134.38,69 RTHERM.P$2 | 136.38,70 144.38,78 DC/DC-ADC.G | 149.38,61.5 157.38,61.5 158.88,63 VR2.1 | v138.88,22 151.38,22 A/DCAP.2 | INA117.8 141.38,42.5 143.38,40.5 158.88,40.5 VCELL.2
ADCVDD  (via drill 0.64)
  Top 0.381: v137.38,23.5 137.38,20.5 137.88,20 HCPL902J.V2 | ADC.VDD 148.38,28.5 146.38,28.5 ADC.VREF | C1.1 143.88,58.5 149.88,58.5 2937ET.OUT 150.38,58.5 152.38,58.5 v152.38,75.5
  Bottom 0.381: v137.38,23.5 140.88,26 143.88,26 145.88,28 ADC.VREF | ADC.VDD 148.38,28 153.88,22.5 A/DCAP.1 154.38,22 154.88,21.5 159.88,21.5 160.88,22.5 160.88,49 148.38,49 144.88,52.5 144.88,58 143.88,58 C1.1 | CELL.3 83.38,101.5 86.38,98.5 154.38,98.5 160.88,92 160.88,82.5 159.38,82.5 VDD.1 158.88,82 v152.38,75.5
CELLO/P
  Bottom 0.381: 148.88,36 150.38,37.5 158.88,37.5 VCELL.1 | 148.88,36 146.88,38 140.88,38 136.38,42.5 INA117.6 | 148.88,36 ADC.CH0
CLK  (via drill 0.64)
  Top 0.381: HCPL902J.OUT1 140.38,20 140.38,27.5 140.88,28 ADC.CLK 141.38,28.5 141.38,30.5 149.38,30.5 v150.88,29
  Bottom 0.381: v150.88,29 153.38,29 158.88,23.5 ADCO/P.5
CS
  Top 0.381: HCPL902J.OUT3 142.88,19.5 142.88,18 144.38,16.5 160.88,16.5 160.88,29 159.38,30.5 ADCO/P.2
  Bottom 0.381: ADC.CS 133.38,28.5 136.38,31.5 158.38,31.5 158.88,31 ADCO/P.2
DC+
  Top 0.381: 10.88,19 10.88,17.5 U$21.TIP 10.88,19 | 10.88,19 10.88,21 4.88,27 DC/DC1A.VIN+ 4.88,27.5 6.38,29 6.38,51.5 5.38,52.5 DC/DC6.VIN+ | 10.88,19 18.88,27 DC/DC2B.VIN+ 19.38,27.5 32.88,27.5 DC/DC3A.VIN+ | DC/DC347.VIN+ 35.88,76.5 36.38,76 36.38,56 33.38,53 DC/DC127.VIN+
  Bottom 0.381: DC/DC6.VIN+ 5.38,52.5 18.88,52.5 DC/DC45.VIN+ 19.38,52.5 32.88,52.5 DC/DC127.VIN+ | DC/DC-ADC.VIN+ 134.38,78 132.88,76.5 35.88,76.5 DC/DC347.VIN+
DC-
  Top 0.381: 20.88,30 19.38,30 DC/DC2B.VIN- | 20.88,30 32.88,30 DC/DC3A.VIN- | DC/DC347.VIN- 32.88,76.5 31.88,75.5 31.88,56.5 32.88,55.5 DC/DC127.VIN- | 20.88,30 20.88,53.5 19.38,55 DC/DC45.VIN-
  Bottom 0.381: 17.88,30 18.88,30 DC/DC2B.VIN- | 17.88,30 4.88,30 DC/DC1A.VIN- | 17.88,30 5.38,17.5 U$21.RING | DC/DC6.VIN- 5.38,55 18.88,55 DC/DC45.VIN- 19.38,55 32.88,55 DC/DC127.VIN- | DC/DC-ADC.VIN- 136.88,78 134.38,75.5 36.88,75.5 36.38,75 34.88,75 33.38,76.5 DC/DC347.VIN-
DIN
  Top 0.381: HCPL902J.OUT2 141.38,19.5 141.38,18.5 140.38,17.5 135.88,17.5 135.88,28 ADC.DIN
  Bottom 0.381: ADCO/P.3 158.88,28.5 156.88,30.5 137.88,30.5 135.88,28.5 ADC.DIN
DOUT  (via drill 0.64)
  Top 0.381: 147.88,17.5 157.38,17.5 157.38,24 158.88,25.5 ADCO/P.4 | 147.88,17.5 144.88,17.5 144.38,18 144.38,19 143.88,19.5 HCPL902J.IN4 | 147.88,17.5 v148.88,18
  Bottom 0.381: v148.88,18 135.38,18 135.38,25 138.38,28 ADC.DOUT
G  (via drill 0.64)
  Top 0.381: v138.88,10.5 138.88,14.5 HCPL902J.G1 | HCPL902J.G11 146.38,14.5 146.38,9 144.88,7.5 CISO.1 | LED4.C 18.88,20.5 24.38,20.5 LED3.C 24.88,20.5 30.38,20.5 LED2.C 30.88,20.5 36.38,20.5 LED1.C 36.88,20.5 v42.38,20.5 | M1BD.IN- 95.88,32 95.88,36.5 91.88,40.5 M3BD.IN- | M7AD.IN- 74.38,53.5 78.38,49.5 78.38,45 74.38,41 M4AD.IN- | UCON.6 99.88,3.5 102.88,6.5 102.88,19 109.38,25.5 109.38,27.5 M1AD.IN-
  Bottom 0.381: v138.88,10.5 141.38,8 143.88,8 144.38,7.5 CISO.1 144.38,7 138.88,1.5 101.38,1.5 99.88,3 UCON.6 99.38,3.5 97.88,5 68.38,5 66.88,3.5 UCON.19 | 57.38,26.5 56.38,27.5 M2BD.IN- | 57.38,26.5 72.88,26.5 73.88,27.5 M2AD.IN- 74.38,28 75.88,29.5 89.88,29.5 91.38,28 M1BD.IN- 91.88,27.5 92.88,26.5 108.38,26.5 109.38,27.5 M1AD.IN- | v42.38,20.5 48.38,26.5 57.38,26.5 | 72.38,55.5 57.88,55.5 56.38,54 M7BD.IN- | 72.38,55.5 73.88,54 M7AD.IN- | 72.38,55.5 89.88,55.5 91.38,54 M6D.IN- 91.88,53.5 93.38,52 107.88,52 109.38,53.5 M5D.IN- | M4BD.IN- 56.38,40.5 57.88,39 72.38,39 73.88,40.5 M4AD.IN- 74.38,40.5 75.88,39 93.38,39 | 93.38,39 91.88,40.5 M3BD.IN- | 93.38,39 94.38,38 106.88,38 109.38,40.5 M3AD.IN-
G1A  (via drill 0.64)
  Top 0.381: v119.38,73 119.88,73.5 119.88,90 123.38,93.5 1AGS.1 | v100.88,68.5 100.88,34 105.38,34 106.88,35.5 M1AD.O/P
  Bottom 0.381: v119.38,73 105.88,73 105.88,70 M1A.G 105.38,69.5 101.88,69.5 v100.88,68.5
G1B  (via drill 0.64)
  Top 0.381: v82.38,36.5 82.38,64 v84.38,66 84.38,83 v86.38,85
  Bottom 0.381: v84.38,66 87.88,69.5 M1B.G | v82.38,36.5 82.88,37 87.88,37 88.88,36 M1BD.O/P | v86.38,85 122.38,85 123.38,86 1BGS.1
G2A  (via drill 0.64)
  Top 0.381: v78.38,72.5 79.38,71.5 79.38,41 75.38,37 71.88,37 71.88,36 M2AD.O/P | v101.38,78 96.88,73.5 v96.88,73
  Bottom 0.381: M2A.G 70.38,70 70.38,72.5 v78.38,72.5 78.88,72.5 79.88,73.5 96.38,73.5 v96.88,73 | v101.38,78 101.88,77.5 122.38,77.5 123.38,78.5 2AGS.1
G2B  (via drill 0.64)
  Top 0.381: v62.38,73 61.88,72.5 61.88,39 56.88,39 53.88,36 M2BD.O/P
  Bottom 0.381: M2B.G 52.38,70 52.38,73 v62.38,73 69.38,73 70.88,74.5 120.38,74.5 123.38,71.5 2BGS.1
G3A  (via drill 0.64)
  Top 0.381: v108.38,64 103.88,68.5 103.88,78.5 105.38,80 M3A.G | v114.88,64 114.88,52 110.88,52 107.38,48.5 M3AD.O/P
  Bottom 0.381: v108.38,64 v114.88,64 123.38,64 3AGS.1
G3B  (via drill 0.64)
  Top 0.381: 84.88,55.5 84.88,52.5 88.88,48.5 M3BD.O/P | 84.88,55.5 84.88,61.5 85.88,62.5 85.88,78 M3B.G | 84.88,55.5 v92.88,55.5
  Bottom 0.381: v92.88,55.5 123.38,55.5 3BGS.1
G4A  (via drill 0.64)
  Top 0.381: v66.88,78 64.38,75.5 v64.38,53
  Bottom 0.381: v66.88,78 67.88,78 69.88,80 M4A.G | v64.38,53 64.38,50 69.88,50 71.38,48.5 M4AD.O/P 71.88,48.5 74.38,51 120.88,51 123.38,48.5 4AGS.1
G4B  (via drill 0.64)
  Top 0.381: v48.38,78 48.38,53.5 53.38,48.5 M4BD.O/P 53.88,48 v56.88,45
  Bottom 0.381: v48.38,78 49.88,78 51.88,80 M4B.G | v56.88,45 57.38,45.5 118.88,45.5 123.38,41 4BGS.1
G5  (via drill 0.64)
  Top 0.381: M5.G 105.38,90 102.88,87.5 102.88,65.5 106.88,61.5 M5D.O/P 106.88,61 101.88,56 101.88,42.5 112.38,42.5 v114.38,40.5
  Bottom 0.381: v114.38,40.5 116.38,40.5 123.38,33.5 5GS.1
G6  (via drill 0.64)
  Top 0.381: M6.G 88.38,90 88.88,89.5 88.88,87 94.38,81.5 94.38,66.5 89.38,61.5 M6D.O/P 89.38,61 97.88,52.5 97.88,32 v98.38,31.5
  Bottom 0.381: v98.38,31.5 117.38,31.5 123.38,25.5 6GS.1
G7A  (via drill 0.64)
  Top 0.381: M7A.G 69.88,90 68.38,88.5 68.38,64.5 71.38,61.5 M7AD.O/P 71.38,61 67.38,57 67.38,51 64.88,48.5 64.88,21.5 v62.88,19.5
  Bottom 0.381: v62.88,19.5 121.88,19.5 123.38,18 7AGS.1
G7B  (via drill 0.64)
  Top 0.381: 49.88,82.5 49.88,62.5 49.38,62 49.38,61 50.88,59.5 53.38,59.5 53.38,61 M7BD.O/P | 49.88,82.5 49.88,88 51.88,90 M7B.G | v50.48,16.5 45.38,22.5 45.38,40.5 46.38,41.5 46.38,79 49.88,82.5
  Bottom 0.381: v50.48,16.5 117.38,16.5 123.38,10.5 7BGS.1
IN+  (via drill 0.64)
  Top 0.381: v155.88,51.5 156.38,52 156.38,78 130.88,103.5 44.38,103.5 44.38,91.5 42.88,90 RS.1 42.38,89.5 42.38,86 35.38,86 U$3.R1 34.88,86 34.88,91 26.88,91 U$1.2
  Bottom 0.381: v155.88,51.5 158.38,51.5 158.88,51 IN+.1
N$1
  Bottom 0.381: M1B.D 90.88,69.5 90.88,67 105.88,67 108.38,69.5 M1A.D
N$2
  Bottom 0.381: M4B.D 54.88,80.5 56.88,82.5 70.88,82.5 72.88,80.5 M4A.D
N$3  (via drill 0.64)
  Top 0.381: v154.88,63 154.88,57 150.88,57 148.88,55 148.88,50 AD8210.VR2
  Bottom 0.381: v154.88,63 157.38,65.5 158.88,65.5 VR2.2
N$4
  Bottom 0.381: M7B.D 54.88,90.5 56.88,92.5 70.88,92.5 72.88,90.5 M7A.D
N$5
  Bottom 0.381: M2B.D 54.88,69.5 56.88,67.5 70.88,67.5 72.88,69.5 M2A.D
N$6  (via drill 0.64)
  Top 0.381: v151.38,47.5 151.38,49.5 AD8210.IN-
  Bottom 0.381: v151.38,47.5 151.88,47 158.88,47 IN-.2
N$7  (via drill 0.64)
  Top 0.381: v150.38,54.5 150.38,50 AD8210.GND
  Bottom 0.381: v150.38,54.5 156.38,60.5 157.88,60.5 158.88,61.5 159.88,61.5 160.88,62.5 160.88,68 158.38,68 157.38,69 157.38,78 158.88,78 GND.2
N$8  (via drill 0.64)
  Top 0.381: v129.38,67.5 129.38,33.5 148.88,33.5 149.88,34.5 149.88,37.5 146.38,41 146.38,46.5 147.88,46.5 148.88,45.5 148.88,45 AD8210.V+
  Bottom 0.381: v129.38,67.5 146.38,84.5 158.88,84.5 VDD.2
N$9
  Bottom 0.381: M3B.D 90.88,80.5 90.88,82.5 106.38,82.5 108.38,80.5 M3A.D
N$10  (via drill 0.64)
  Top 0.381: v161.88,75 161.88,42.5 158.88,42.5 157.88,41.5 149.38,41.5 147.88,43 147.88,44 147.38,44.5 AD8210.O/P
  Bottom 0.381: v161.88,75 159.38,72.5 O/P.2
N$11  (via drill 0.64)
  Top 0.381: v154.38,55.5 154.38,42.5 150.88,42.5 150.38,43 150.38,44.5 AD8210.VR1
  Bottom 0.381: v154.38,55.5 157.88,59 158.88,59 VR1.2
N$12  (via drill 0.64)
  Top 0.381: v152.88,50.5 152.88,46.5 151.38,45 AD8210.IN+
  Bottom 0.381: v152.88,50.5 155.38,53 158.88,53 IN+.2
N$13  (via drill 0.64)
  Top 0.381: v100.88,7 97.38,3.5 UCON.7
  Bottom 0.381: v100.88,7 101.38,7.5 114.38,7.5 116.88,10 1A.P$1
N$14  (via drill 0.64)
  Top 0.381: v101.38,10 94.88,3.5 UCON.8
  Bottom 0.381: v101.38,10 103.38,12 108.88,12 110.38,10.5 1B.P$1
N$15  (via drill 0.64)
  Top 0.381: v95.88,7 92.38,3.5 UCON.9
  Bottom 0.381: v95.88,7 97.38,8.5 102.88,8.5 104.38,10 2A.P$1
N$16  (via drill 0.64)
  Top 0.381: v89.88,10.5 89.88,3.5 UCON.10
  Bottom 0.381: v89.88,10.5 91.38,12 96.38,12 97.88,10.5 2B.P$1
N$17
  Top 0.381: UCON.11 86.88,3.5 85.88,4.5 85.88,10 3A.P$1
N$18  (via drill 0.64)
  Top 0.381: v83.38,7 83.38,4.5 84.38,3.5 UCON.12
  Bottom 0.381: v83.38,7 80.38,10 79.38,10 3B.P$1
N$19  (via drill 0.64)
  Top 0.381: v81.88,6.5 81.88,3.5 UCON.13
  Bottom 0.381: v81.88,6.5 76.38,6.5 72.88,10 4A.P$1
N$20
  Top 0.381: UCON.14 79.38,3.5 80.38,4.5 80.38,7.5 84.88,12 91.38,12 91.38,10.5 4B.P$1
N$21  (via drill 0.64)
  Top 0.381: v73.38,6.5 76.38,3.5 UCON.15
  Bottom 0.381: v73.38,6.5 70.38,6.5 66.88,10 5.P$1
N$22
  Bottom 0.381: 6.P$1 59.88,10 54.88,5 50.38,5 49.88,4.5 49.88,1.5 72.38,1.5 73.88,3 UCON.16
N$23
  Top 0.381: 7A.P$1 53.88,10.5 58.38,10.5 58.38,11 59.38,12 70.88,12 70.88,4 71.38,3.5 UCON.17
N$24
  Top 0.381: 7B.P$1 47.38,10 51.88,10 51.88,9.5 53.38,8 68.88,8 68.88,3.5 UCON.18
N$25
  Top 0.381: LED2.A 30.88,18 30.88,14.5 R2.2
N$26
  Top 0.381: LED1.A 36.88,18 36.88,14.5 R1.2
N$27
  Top 0.381: LED4.A 18.38,18 18.38,14 R4.2
N$28
  Top 0.381: R2.1 30.88,12 36.88,6 61.38,6 61.38,3.5 UCON.21
N$31
  Top 0.381: R3.1 24.88,11.5 31.38,5 58.88,5 58.88,3.5 UCON.22
N$32
  Top 0.381: LED3.A 24.88,18 24.88,14 R3.2
N$34
  Top 0.381: R4.1 18.38,11.5 28.38,1.5 56.38,1.5 56.38,3 UCON.23
R4
  Top 0.381: R1.1 36.88,12 45.38,12 45.38,10 48.38,7 63.88,7 63.88,3.5 UCON.20
S1A  (via drill 0.64)
  Top 0.381: 1AGS.2 123.38,96.5 117.88,91 117.88,72 v117.38,71.5 117.38,71 119.38,69 v119.38,35 | v130.88,38 130.88,45 135.88,50 INA117.3
  Bottom 0.381: v117.38,71.5 112.38,71.5 110.88,70 M1A.S | CELL.1 77.88,101.5 82.38,97 123.38,97 1AGS.2 | DC/DC1A.G 4.88,37.5 5.88,36.5 13.88,36.5 C1A.2 14.38,36 18.88,31.5 40.88,31.5 41.38,31 73.38,31 75.38,33 109.38,33 111.88,35.5 M1AD.V- 112.38,35.5 117.88,35.5 118.88,34.5 | v130.88,38 124.38,31.5 121.88,31.5 118.88,34.5 | 118.88,34.5 v119.38,35
S2B  (via drill 0.64)
  Top 0.381: v58.88,85 58.88,71 57.88,70 M2B.S 57.38,69.5 55.38,67.5 v53.38,67.5 | v125.38,87.5 125.38,75.5 123.88,74 2BGS.2 | LEFT.2 5.88,91 10.38,86.5 10.38,47.5 17.88,40 17.88,39 18.88,38 DC/DC2B.G
  Bottom 0.381: v58.88,85 61.38,87.5 105.88,87.5 | 105.88,87.5 108.38,90 M5.D | v125.38,87.5 125.38,90.5 113.88,90.5 110.88,87.5 105.88,87.5 | DC/DC2B.G 19.38,37.5 20.38,36.5 27.88,36.5 C2B.2 28.38,36 30.88,33.5 33.88,33.5 34.38,34 56.88,34 58.38,35.5 M2BD.V- | v53.38,67.5 38.88,67.5 33.38,73 12.38,73 7.38,78 7.38,91 5.88,91 LEFT.2
S3A  (via drill 0.64)
  Top 0.381: 40.88,37.5 33.38,37.5 DC/DC3A.G | 40.88,37.5 40.88,33.5 41.88,32.5 C3A.2 | v111.88,67.5 112.38,68 112.38,78.5 110.88,80 M3A.S | v116.38,66.5 116.38,48.5 112.38,48.5 M3AD.V- | v83.38,85 83.38,98 80.88,101.5 CELL.2 80.38,101.5 80.38,100 59.38,100 40.88,81.5 40.88,37.5
  Bottom 0.381: INA117.2 138.38,50.5 134.38,54.5 133.38,54.5 125.38,62.5 125.38,66 123.88,66 3AGS.2 123.38,66.5 v116.38,66.5 112.88,66.5 v111.88,67.5 | v83.38,85 85.88,83.5 107.88,83.5 110.88,80.5 M3A.S
S6  (via drill 0.64)
  Top 0.381: U$1.1 18.38,91 15.88,88.5 15.88,63 14.38,61.5 C6.2 | M6D.V- 94.38,61.5 95.38,62.5 95.38,88 93.38,90 M6.S 93.38,90.5 93.38,92.5 111.38,92.5 114.38,89.5 114.38,72.5 117.88,69 v117.88,33.5
  Bottom 0.381: DC/DC6.G 5.38,62.5 6.38,61.5 13.88,61.5 C6.2 14.38,61 16.88,58.5 33.88,58.5 34.88,59.5 49.38,59.5 50.38,58.5 91.38,58.5 93.88,61 M6D.V- | v117.88,33.5 123.38,28 6GS.2
S54  (via drill 0.64)
  Top 0.381: M4BD.V- 58.88,48.5 60.88,50.5 60.88,77.5 v61.38,78 61.38,78.5 67.38,84.5 v67.38,94 | v28.88,51 28.88,60.5 28.38,61 C54B.2 | 5GS.2 123.38,36 121.88,37.5 121.88,41.5 123.38,43 4BGS.2 123.38,43.5 121.88,45 121.88,59 v123.38,60.5 | M5.S 110.88,90 113.38,87.5 113.38,62.5 112.38,61.5 M5D.V-
  Bottom 0.381: DC/DC45.G 19.38,62.5 20.38,61.5 27.88,61.5 C54B.2 | v61.38,78 59.88,78 57.88,80 M4B.S | v28.88,51 29.88,50 56.88,50 58.38,48.5 M4BD.V- | 110.88,90.5 111.88,91.5 158.88,91.5 RIGHT.2 | v123.38,60.5 120.88,61 112.38,61 M5D.V- | v67.38,94 67.88,93.5 107.88,93.5 110.88,90.5 | 110.88,90.5 M5.S
S127  (via drill 0.64)
  Top 0.381: 121.88,79.5 123.38,81 2AGS.2 | 121.88,79.5 120.88,78.5 120.88,23 123.38,20.5 7AGS.2 | 121.88,79.5 121.88,87 123.38,88.5 1BGS.2 123.88,89 125.38,90.5 125.38,97 123.88,98.5 94.88,98.5 94.88,95.5 90.88,91.5 90.88,90.5 M6.D | M7AD.V- 76.38,61.5 76.38,68.5 75.38,69.5 M2A.S 75.38,70 76.88,71.5 76.88,76 | v34.88,57.5 34.88,61 33.38,62.5 DC/DC127.G | 76.88,76 76.88,88.5 75.38,90 M7A.S | 76.88,76 80.38,72.5 80.38,39.5 76.88,36 M2AD.V-
  Bottom 0.381: M2AD.V- 76.88,36 78.88,38 91.88,38 93.88,36 M1BD.V- | M7A.S 75.38,90.5 77.38,92.5 88.38,92.5 90.38,90.5 M6.D | DC/DC127.G 33.38,62.5 35.38,60.5 49.88,60.5 50.88,59.5 74.88,59.5 76.38,61 M7AD.V- | M1B.S 92.88,70 92.88,72.5 80.38,72.5 77.88,70 75.38,70 M2A.S | C127.2 41.88,57.5 v34.88,57.5 3.38,57.5 3.38,66 4.38,67 5.38,67 5.38,88.5 LEFT.1
S347
  Top 0.381: M7BD.V- 58.88,61.5 59.88,62.5 59.88,84 60.38,84.5 60.38,87.5 57.88,90 M7B.S | U$3.R2 35.38,96.5 42.38,96.5 42.38,92.5 RS.2 | 125.38,49 125.38,14.5 123.88,13 7BGS.2 | 125.38,49 123.88,50.5 4AGS.2 | 125.38,49 125.38,56 123.88,57.5 3BGS.2 123.88,58 126.88,61 126.88,99.5 94.38,99.5 86.38,91.5 86.38,87 92.88,80.5 M3B.S | RIGHT.1 158.88,88.5 157.38,87 157.38,46 158.88,44.5 IN-.1
  Bottom 0.381: M3B.S 93.38,80 90.88,77.5 77.88,77.5 75.38,80 M4A.S 74.88,80.5 74.88,83.5 58.38,83.5 54.38,87.5 | C347.2 12.38,80.5 21.88,80.5 25.38,77 DC/DC347.G 25.88,77 40.88,92 42.38,92 RS.2 42.88,92 47.38,87.5 54.38,87.5 | 54.38,87.5 57.38,87.5 57.38,90 M7B.S | M4AD.V- 76.88,48.5 78.38,50 92.38,50 93.88,48.5 M3BD.V- 94.38,48 95.88,46.5 127.88,46.5 | 127.88,46.5 123.88,50.5 4AGS.2 | 127.88,46.5 128.38,46 157.38,46 158.88,44.5 IN-.1
SHUNTO/P  (via drill 0.64)
  Top 0.381: v147.38,52 145.38,50 145.38,36.5 145.88,36 ADC.CH1
  Bottom 0.381: v147.38,52 148.38,53 153.88,53 155.88,55 159.38,55 161.88,57.5 161.88,69.5 159.38,69.5 O/P.1
TEMP  (via drill 0.64)
  Top 0.381: v143.88,49.5 143.88,36 ADC.CH2 | CELL.4 85.88,101.5 131.38,101.5 131.38,59 133.88,56.5 RTHERM.P$1
  Bottom 0.381: v143.88,49.5 137.38,56 134.38,56 RTHERM.P$1
UCLK
  Top 0.381: HCPL902J.IN1 140.18,15 140.18,16.1 139.38,16.5 126.38,16.5 126.38,10.5 120.88,5 109.88,5 109.88,3.5 UCON.2
UCS  (via drill 0.64)
  Top 0.381: 142.88,14.5 HCPL902J.IN3
  Top 0.406: 142.88,14.5 v142.88,12
  Bottom 0.381: v142.88,12 127.88,12 121.88,6 107.38,6 104.88,3.5 UCON.4
UDIN  (via drill 0.64)
  Top 0.381: v141.38,6.5 141.38,14.5 HCPL902J.IN2
  Bottom 0.381: v141.38,6.5 139.88,5 108.88,5 107.38,3.5 UCON.3
UDOUT
  Top 0.381: HCPL902J.OUT4 143.88,14.5 144.38,14 144.38,9.5 142.88,8 142.88,5.5 138.88,1.5 102.38,1.5 102.38,3 UCON.5
V1+  (via drill 0.64)
  Top 0.381: v44.88,42 43.88,43 43.88,61 42.38,62.5 C127.1
  Bottom 0.381: M1BD.V+ 86.38,35.5 84.88,34 70.88,34 69.38,35.5 M2AD.V+ 68.88,36 66.88,38 48.88,38 v44.88,42 | DC/DC127.V+ 33.38,65 35.38,63 41.88,63 C127.1 42.38,63 67.38,63 68.88,61.5 M7AD.V+
V1A  (via drill 0.64)
  Top 0.381: v102.38,39.5 102.38,38 104.38,36 M1AD.V+
  Bottom 0.381: DC/DC1A.V+ 4.88,40.5 5.38,41 13.88,41 C1A.1 14.38,41.5 16.38,43.5 45.38,43.5 46.38,42.5 99.38,42.5 v102.38,39.5
V2+  (via drill 0.64)
  Top 0.381: C54B.1 28.38,66 29.88,64.5 29.88,54 v35.38,48.5 35.88,48.5 v38.88,51.5
  Bottom 0.381: DC/DC45.V+ 19.38,65.5 19.88,66 27.88,66 C54B.1 | v35.38,48.5 50.88,48.5 M4BD.V+ | v38.88,51.5 44.38,57 100.38,57 104.38,61 M5D.V+
V2B
  Bottom 0.381: DC/DC2B.V+ 19.38,40.5 19.88,41 27.88,41 C2B.1 28.38,41.5 40.38,41.5 44.88,37 49.88,37 50.88,36 M2BD.V+
V3+  (via drill 0.64)
  Top 0.381: v51.38,74 50.88,73.5 50.88,61.5 M7BD.V+ | v31.38,46.5 23.38,54.5 23.38,76.5 DC/DC347.V+
  Bottom 0.381: M3BD.V+ 86.38,48 84.88,46.5 70.88,46.5 69.38,48 M4AD.V+ 68.88,48 67.38,46.5 v31.38,46.5 | C347.1 12.38,76 22.38,76 22.88,76.5 DC/DC347.V+ 23.38,76.5 25.88,74 v51.38,74
V3A
  Top 0.381: M3AD.V+ 104.88,48 108.38,44.5 116.88,44.5 116.88,36.5 109.88,29.5 100.38,29.5 100.38,17 98.38,15 43.88,15 43.88,35.5 42.38,37 C3A.1
  Bottom 0.381: DC/DC3A.V+ 33.38,40 35.88,37.5 41.88,37.5 C3A.1
V6
  Bottom 0.381: DC/DC6.V+ 5.38,65.5 5.88,66 13.88,66 C6.1 14.38,66.5 15.88,68 32.88,68 34.88,66 81.88,66 86.38,61.5 M6D.V+
VISO
  Top 0.381: 137.68,9.5 139.38,7.5 CISO.2 139.38,7 139.38,3.5 112.88,3.5 UCON.1
  Top 0.406: 137.68,9.5 137.68,14 137.66,14 HCPL902J.V1
VREG+
  Top 0.381: INA117.7 138.88,42.5 140.38,41 142.38,41 142.38,55.5 141.88,56 141.88,59 145.88,63 149.88,63 2937ET.IN 149.88,64 149.88,76 147.88,78 DC/DC-ADC.V+
VREG-
  Top 0.381: INA117.4 133.38,50.5 139.88,57 139.88,76 141.88,78 DC/DC-ADC.V-

### Text on the board
tNames: C+ | C- | T+ | T- | 2 | 2 | C347 | 2 | 2 | 2 | 2 | 2 | C:/Users/swaminathan.narayana/Documents/logo/tum create logo.bmp